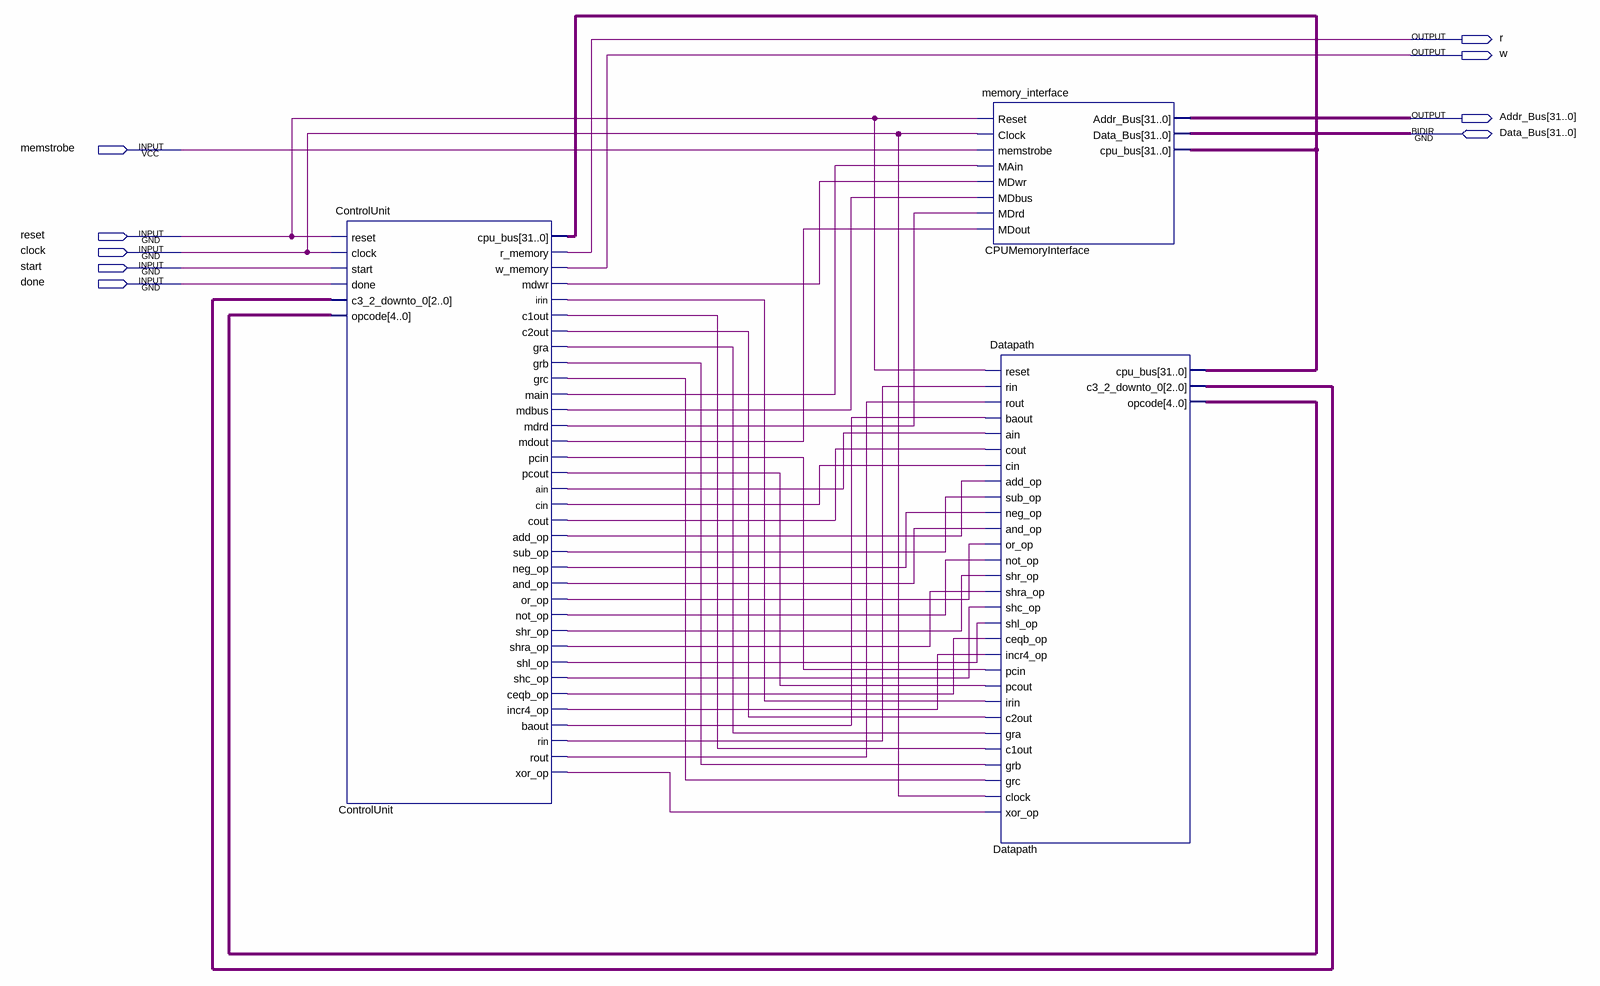
[diagram p0: schematic sheet]
// Quartus schematic CPU.bdf as structural Verilog: 3 symbols, 9 pins
module CPU (
  input  memstrobe,
  input  reset,
  input  clock,
  input  start,
  input  done,
  inout  [31:0] Data_Bus,
  output r,
  output w,
  output [31:0] Addr_Bus
);

  wire ControlUnit_add_op, ControlUnit_ain, ControlUnit_and_op, ControlUnit_baout, ControlUnit_c1out,
       ControlUnit_c2out, ControlUnit_ceqb_op, ControlUnit_cin, ControlUnit_cout, ControlUnit_gra,
       ControlUnit_grb, ControlUnit_grc, ControlUnit_incr4_op, ControlUnit_irin, ControlUnit_main,
       ControlUnit_mdbus, ControlUnit_mdout, ControlUnit_mdrd, ControlUnit_mdwr, ControlUnit_neg_op,
       ControlUnit_not_op, ControlUnit_or_op, ControlUnit_pcin, ControlUnit_pcout, ControlUnit_rin,
       ControlUnit_rout, ControlUnit_shc_op, ControlUnit_shl_op, ControlUnit_shr_op, ControlUnit_shra_op,
       ControlUnit_sub_op, ControlUnit_xor_op;
  wire [2:0] Datapath_c3_2_downto_0;
  wire [4:0] Datapath_opcode;
  wire [31:0] ControlUnit_cpu_bus;

  ControlUnit ControlUnit (
    .reset(reset), .clock(clock), .start(start), .done(done), .c3_2_downto_0(Datapath_c3_2_downto_0),
    .opcode(Datapath_opcode), .r_memory(r), .w_memory(w), .mdwr(ControlUnit_mdwr), .irin(ControlUnit_irin),
    .c1out(ControlUnit_c1out), .c2out(ControlUnit_c2out), .gra(ControlUnit_gra), .grb(ControlUnit_grb),
    .grc(ControlUnit_grc), .main(ControlUnit_main), .mdbus(ControlUnit_mdbus), .mdrd(ControlUnit_mdrd),
    .mdout(ControlUnit_mdout), .pcin(ControlUnit_pcin), .pcout(ControlUnit_pcout), .ain(ControlUnit_ain),
    .cin(ControlUnit_cin), .cout(ControlUnit_cout), .add_op(ControlUnit_add_op), .sub_op(ControlUnit_sub_op),
    .neg_op(ControlUnit_neg_op), .and_op(ControlUnit_and_op), .or_op(ControlUnit_or_op),
    .not_op(ControlUnit_not_op), .shr_op(ControlUnit_shr_op), .shra_op(ControlUnit_shra_op),
    .shl_op(ControlUnit_shl_op), .shc_op(ControlUnit_shc_op), .ceqb_op(ControlUnit_ceqb_op),
    .incr4_op(ControlUnit_incr4_op), .baout(ControlUnit_baout), .rin(ControlUnit_rin),
    .rout(ControlUnit_rout), .xor_op(ControlUnit_xor_op), .cpu_bus(ControlUnit_cpu_bus));
  memory_interface CPUMemoryInterface (
    .Reset(reset), .Clock(clock), .memstrobe(memstrobe), .MAin(ControlUnit_main), .MDwr(ControlUnit_mdwr),
    .MDbus(ControlUnit_mdbus), .MDrd(ControlUnit_mdrd), .MDout(ControlUnit_mdout), .Addr_Bus(Addr_Bus),
    .Data_Bus(Data_Bus), .cpu_bus(ControlUnit_cpu_bus));
  Datapath Datapath (
    .reset(reset), .rin(ControlUnit_rin), .rout(ControlUnit_rout), .baout(ControlUnit_baout),
    .ain(ControlUnit_ain), .cout(ControlUnit_cout), .cin(ControlUnit_cin), .add_op(ControlUnit_add_op),
    .sub_op(ControlUnit_sub_op), .neg_op(ControlUnit_neg_op), .and_op(ControlUnit_and_op),
    .or_op(ControlUnit_or_op), .not_op(ControlUnit_not_op), .shr_op(ControlUnit_shr_op),
    .shra_op(ControlUnit_shra_op), .shc_op(ControlUnit_shc_op), .shl_op(ControlUnit_shl_op),
    .ceqb_op(ControlUnit_ceqb_op), .incr4_op(ControlUnit_incr4_op), .pcin(ControlUnit_pcin),
    .pcout(ControlUnit_pcout), .irin(ControlUnit_irin), .c2out(ControlUnit_c2out), .gra(ControlUnit_gra),
    .c1out(ControlUnit_c1out), .grb(ControlUnit_grb), .grc(ControlUnit_grc), .clock(clock),
    .xor_op(ControlUnit_xor_op), .c3_2_downto_0(Datapath_c3_2_downto_0), .opcode(Datapath_opcode),
    .cpu_bus(ControlUnit_cpu_bus));
endmodule
